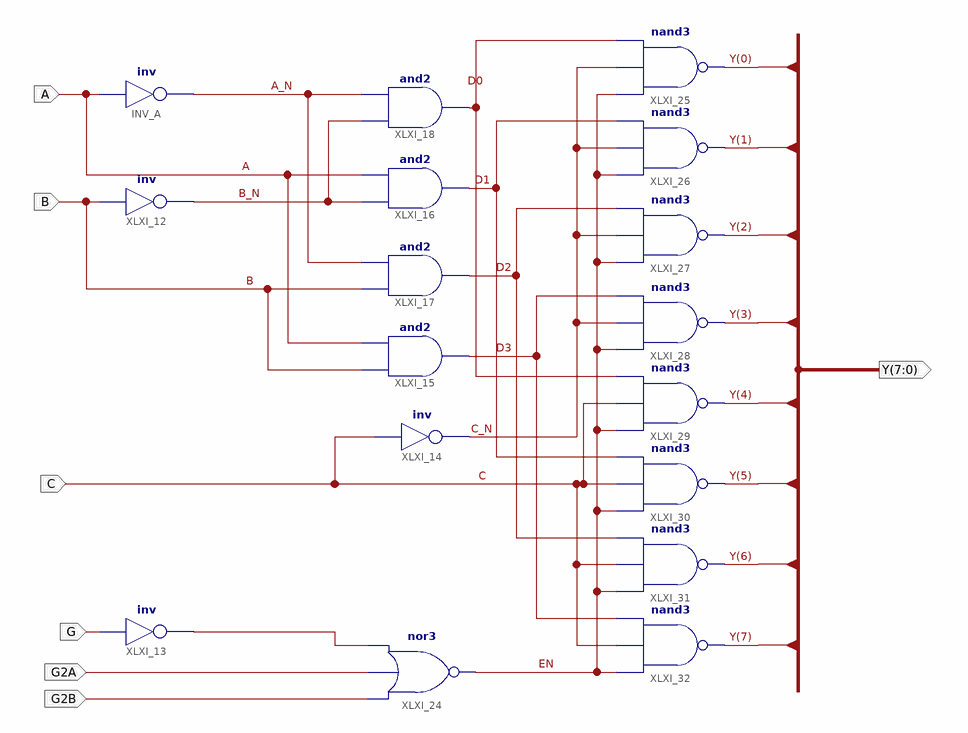
[diagram p0: schematic sheet 1]
// Xilinx ISE schematic D_74LS138.sch (kintex7) as structural Verilog: 17 symbols, 7 ports
module D_74LS138 (
  input  B,
  input  A,
  input  C,
  input  G,
  input  G2A,
  input  G2B,
  output [7:0] Y
);

  wire A_N, B_N, C_N, D0, D1, D2, D3, EN, XLXN_16;

  not INV_A (A_N, A);
  not XLXI_14 (C_N, C);
  and XLXI_15 (D3, B, A);
  and XLXI_16 (D1, B_N, A);
  and XLXI_17 (D2, B, A_N);
  and XLXI_18 (D0, B_N, A_N);
  not XLXI_12 (B_N, B);
  nand XLXI_25 (Y[0], EN, C_N, D0);
  nand XLXI_26 (Y[1], EN, C_N, D1);
  nand XLXI_27 (Y[2], EN, C_N, D2);
  nand XLXI_28 (Y[3], EN, C_N, D3);
  nand XLXI_29 (Y[4], EN, C, D0);
  nand XLXI_30 (Y[5], EN, C, D1);
  nand XLXI_31 (Y[6], EN, C, D2);
  nand XLXI_32 (Y[7], EN, C, D3);
  not XLXI_13 (XLXN_16, G);
  nor XLXI_24 (EN, G2B, G2A, XLXN_16);
endmodule
